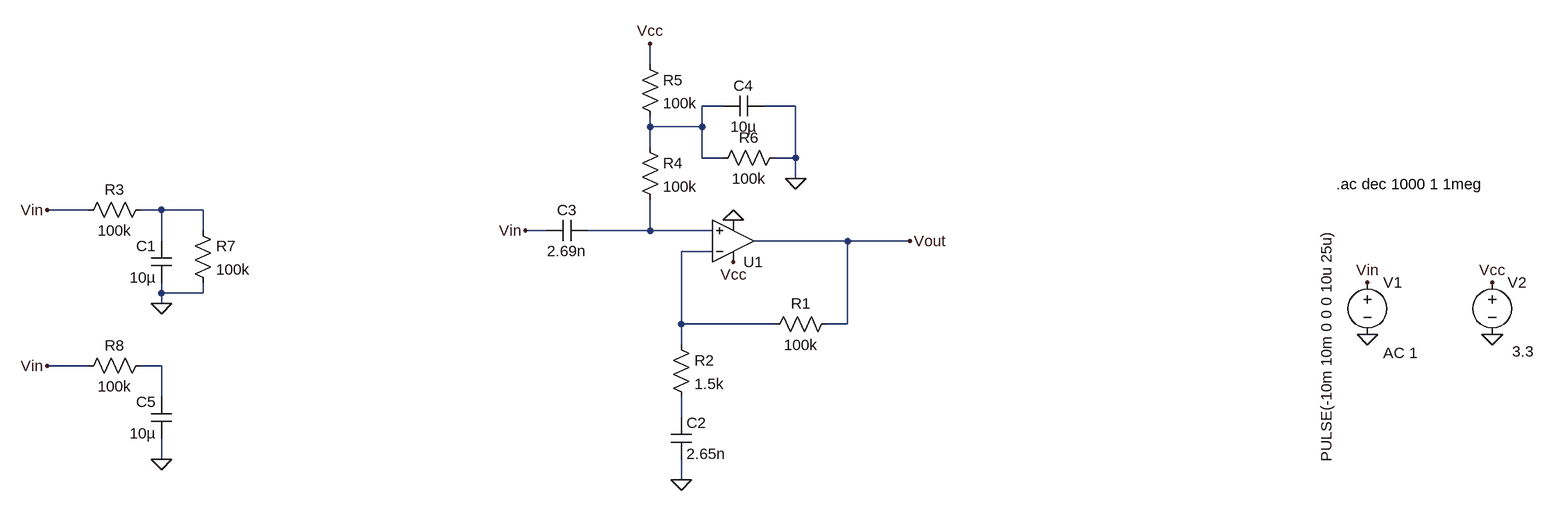
[diagram p0: schematic Draft1.asc]
Draft1.asc, the LTspice schematic file:
Version 4
SHEET 1 2068 680
WIRE 464 -272 464 -304
WIRE 576 -208 544 -208
WIRE 688 -208 640 -208
WIRE 464 -176 464 -192
WIRE 544 -176 544 -208
WIRE 544 -176 464 -176
WIRE 464 -144 464 -176
WIRE 544 -128 544 -176
WIRE 576 -128 544 -128
WIRE 688 -128 688 -208
WIRE 688 -128 656 -128
WIRE 688 -96 688 -128
WIRE -400 -48 -464 -48
WIRE -288 -48 -320 -48
WIRE -224 -48 -288 -48
WIRE -224 -16 -224 -48
WIRE 304 -16 272 -16
WIRE 464 -16 464 -64
WIRE 464 -16 368 -16
WIRE 560 -16 464 -16
WIRE -288 0 -288 -48
WIRE 768 0 624 0
WIRE 864 0 768 0
WIRE 560 16 512 16
WIRE -288 80 -288 64
WIRE -224 80 -224 64
WIRE -224 80 -288 80
WIRE -288 96 -288 80
WIRE 512 128 512 16
WIRE 656 128 512 128
WIRE 768 128 768 0
WIRE 768 128 736 128
WIRE 512 160 512 128
WIRE -400 192 -464 192
WIRE -288 192 -320 192
WIRE -288 240 -288 192
WIRE 512 272 512 240
WIRE -288 336 -288 304
WIRE 512 368 512 336
FLAG 1568 64 Vin
FLAG 1568 144 0
FLAG 1760 64 Vcc
FLAG 1760 144 0
FLAG 592 32 Vcc
FLAG 592 -32 0
FLAG 272 -16 Vin
FLAG 864 0 Vout
FLAG 688 -96 0
FLAG 464 -304 Vcc
FLAG 512 368 0
FLAG -288 96 0
FLAG -464 -48 Vin
FLAG -288 336 0
FLAG -464 192 Vin
SYMBOL voltage 1568 48 R0
WINDOW 123 24 124 Left 2
WINDOW 39 0 0 Left 0
WINDOW 3 -63 -67 VRight 2
SYMATTR Value2 AC 1
SYMATTR InstName V1
SYMATTR Value PULSE(-10m 10m 0 0 0 10u 25u)
SYMBOL voltage 1760 48 R0
WINDOW 3 31 122 Left 2
WINDOW 123 24 124 Left 2
WINDOW 39 0 0 Left 0
SYMATTR Value 3.3
SYMATTR InstName V2
SYMBOL res 752 112 R90
WINDOW 0 0 56 VBottom 2
WINDOW 3 32 56 VTop 2
SYMATTR InstName R1
SYMATTR Value 100k
SYMBOL res 496 144 R0
SYMATTR InstName R2
SYMATTR Value 1.5k
SYMBOL cap 368 -32 R90
WINDOW 0 0 32 VBottom 2
WINDOW 3 32 32 VTop 2
SYMATTR InstName C3
SYMATTR Value 2.69n
SYMBOL res 448 -160 R0
SYMATTR InstName R4
SYMATTR Value 100k
SYMBOL res 448 -288 R0
SYMATTR InstName R5
SYMATTR Value 100k
SYMBOL res 672 -144 R90
WINDOW 0 0 56 VBottom 2
WINDOW 3 32 56 VTop 2
SYMATTR InstName R6
SYMATTR Value 100k
SYMBOL cap 640 -224 R90
WINDOW 0 0 32 VBottom 2
WINDOW 3 32 32 VTop 2
SYMATTR InstName C4
SYMATTR Value 10µ
SYMBOL cap 496 272 R0
SYMATTR InstName C2
SYMATTR Value 2.65n
SYMBOL OpAmps\\UniversalOpAmp 592 0 M180
SYMATTR InstName U1
SYMATTR Value2 Avol=1Meg GBW=2.8Meg Vos=0
SYMBOL cap -272 64 R180
WINDOW 0 24 56 Left 2
WINDOW 3 24 8 Left 2
SYMATTR InstName C1
SYMATTR Value 10µ
SYMBOL res -304 -64 R90
WINDOW 0 0 56 VBottom 2
WINDOW 3 32 56 VTop 2
SYMATTR InstName R3
SYMATTR Value 100k
SYMBOL res -240 -32 R0
SYMATTR InstName R7
SYMATTR Value 100k
SYMBOL cap -272 304 R180
WINDOW 0 24 56 Left 2
WINDOW 3 24 8 Left 2
SYMATTR InstName C5
SYMATTR Value 10µ
SYMBOL res -304 176 R90
WINDOW 0 0 56 VBottom 2
WINDOW 3 32 56 VTop 2
SYMATTR InstName R8
SYMATTR Value 100k
TEXT 1520 -88 Left 2 !.ac dec 1000 1 1meg

The netlist it stands for:
* Draft1.asc
V1 Vin 0 PULSE(-10m 10m 0 0 0 10u 25u) AC 1
V2 Vcc 0 3.3
R1 Vout N004 100k
R2 N004 N006 1.5k
C3 N003 Vin 2.69n
R4 N001 N003 100k
R5 Vcc N001 100k
R6 0 N001 100k
C4 0 N001 10µ
C2 N006 0 2.65n
XU1 N003 N004 Vcc 0 Vout level1 Avol=1Meg GBW=2.8Meg Vos=0 En=0 Enk=0 In=0 Ink=0 Rin=500Meg  ; pins In+ In- V+ V- OUT
C1 0 N002 10µ
R3 N002 Vin 100k
R7 N002 0 100k
C5 0 N005 10µ
R8 N005 Vin 100k
.ac dec 1000 1 1meg
.lib UniversalOpAmp1.lib
.backanno
.end